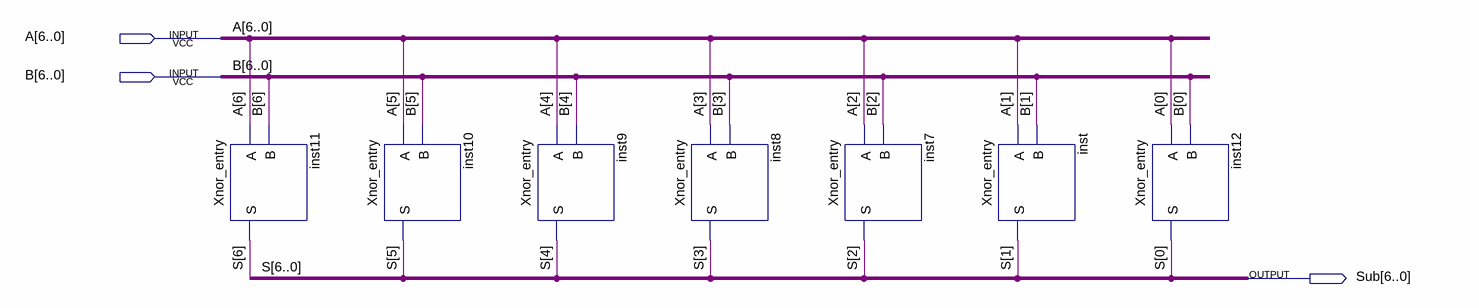
[diagram p0: schematic sheet]
// Quartus schematic Seven_bit_Xnor.bdf as structural Verilog: 7 symbols, 3 pins
module Seven_bit_Xnor (
  input  [6:0] A,
  input  [6:0] B,
  output [6:0] Sub
);

  Xnor_entry inst11 (.A(A[6]), .B(B[6]), .S(Sub[6]));
  Xnor_entry inst10 (.A(A[5]), .B(B[5]), .S(Sub[5]));
  Xnor_entry inst9 (.A(A[4]), .B(B[4]), .S(Sub[4]));
  Xnor_entry inst8 (.A(A[3]), .B(B[3]), .S(Sub[3]));
  Xnor_entry inst7 (.A(A[2]), .B(B[2]), .S(Sub[2]));
  Xnor_entry inst (.A(A[1]), .B(B[1]), .S(Sub[1]));
  Xnor_entry inst12 (.A(A[0]), .B(B[0]), .S(Sub[0]));

  // Other names for the same wires on the sheet: S[6:0] = Sub
endmodule
